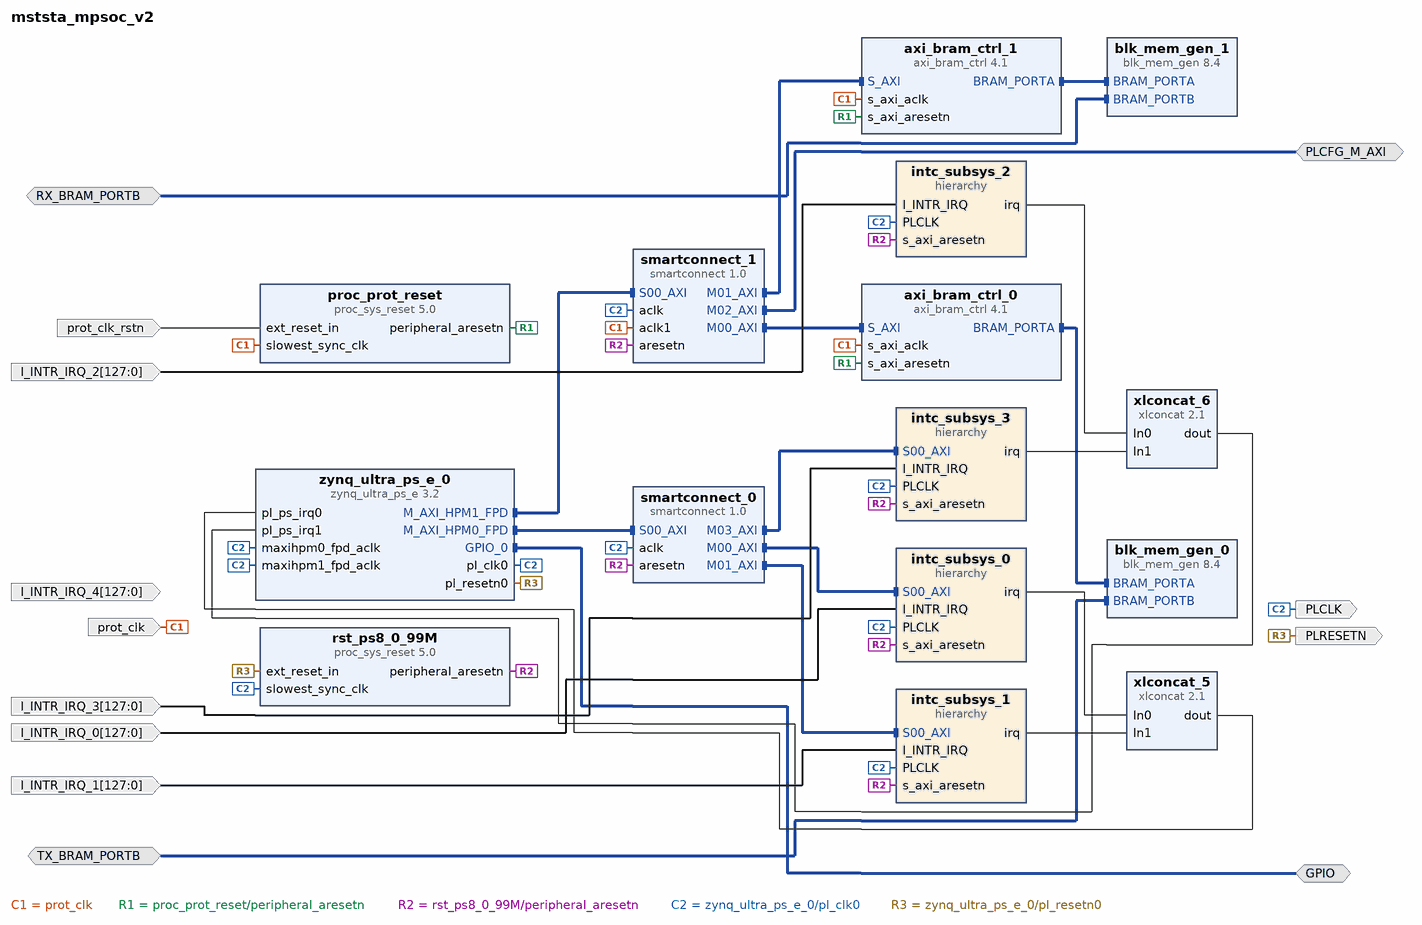
[diagram p0: block diagram of the top level]
# Vivado block design mststa_mpsoc_v2, xczu5eg-sfvc784-2-i, Vivado 2018.3
create_bd_design mststa_mpsoc_v2

create_bd_intf_port -mode Master -vlnv xilinx.com:interface:gpio_rtl:1.0 GPIO
create_bd_intf_port -mode Master -vlnv xilinx.com:interface:aximm_rtl:1.0 PLCFG_M_AXI
set_property -dict {CONFIG.ADDR_WIDTH 32 CONFIG.DATA_WIDTH 32 CONFIG.PROTOCOL AXI4LITE} [get_bd_intf_ports PLCFG_M_AXI]
create_bd_intf_port -mode Slave -vlnv xilinx.com:interface:bram_rtl:1.0 RX_BRAM_PORTB
set_property -dict {CONFIG.MASTER_TYPE BRAM_CTRL CONFIG.MEM_SIZE 65536 CONFIG.READ_LATENCY 1} [get_bd_intf_ports RX_BRAM_PORTB]
create_bd_intf_port -mode Slave -vlnv xilinx.com:interface:bram_rtl:1.0 TX_BRAM_PORTB
set_property -dict {CONFIG.MASTER_TYPE BRAM_CTRL CONFIG.MEM_SIZE 65536 CONFIG.READ_LATENCY 1} [get_bd_intf_ports TX_BRAM_PORTB]
create_bd_port -dir I -from 127 -to 0 I_INTR_IRQ_0
create_bd_port -dir I -from 127 -to 0 I_INTR_IRQ_1
create_bd_port -dir I -from 127 -to 0 I_INTR_IRQ_2
create_bd_port -dir I -from 127 -to 0 I_INTR_IRQ_3
create_bd_port -dir I -from 127 -to 0 I_INTR_IRQ_4
create_bd_port -dir O -type clk PLCLK
set_property -dict {CONFIG.ASSOCIATED_BUSIF PLCFG_M_AXI} [get_bd_ports PLCLK]
create_bd_port -dir O -type rst PLRESETN
create_bd_port -dir I -type clk prot_clk
set_property -dict {CONFIG.FREQ_HZ 156250000} [get_bd_ports prot_clk]
create_bd_port -dir I -type rst prot_clk_rstn

create_bd_cell -type ip -vlnv xilinx.com:ip:axi_bram_ctrl:4.1 axi_bram_ctrl_0
set_property -dict {CONFIG.PROTOCOL AXI4LITE CONFIG.SINGLE_PORT_BRAM 1} [get_bd_cells axi_bram_ctrl_0]
create_bd_cell -type ip -vlnv xilinx.com:ip:axi_bram_ctrl:4.1 axi_bram_ctrl_1
set_property -dict {CONFIG.PROTOCOL AXI4LITE CONFIG.SINGLE_PORT_BRAM 1} [get_bd_cells axi_bram_ctrl_1]
create_bd_cell -type ip -vlnv xilinx.com:ip:blk_mem_gen:8.4 blk_mem_gen_0
set_property -dict [list \
  CONFIG.Memory_Type True_Dual_Port_RAM \
  CONFIG.PRIM_type_to_Implement URAM \
  CONFIG.Port_B_Clock 100 \
  CONFIG.Port_B_Enable_Rate 100 \
  CONFIG.Port_B_Write_Rate 50 \
  CONFIG.Use_RSTB_Pin true \
] [get_bd_cells blk_mem_gen_0]
create_bd_cell -type ip -vlnv xilinx.com:ip:blk_mem_gen:8.4 blk_mem_gen_1
set_property -dict [list \
  CONFIG.Memory_Type True_Dual_Port_RAM \
  CONFIG.PRIM_type_to_Implement URAM \
  CONFIG.Port_B_Clock 100 \
  CONFIG.Port_B_Enable_Rate 100 \
  CONFIG.Port_B_Write_Rate 50 \
  CONFIG.Use_RSTB_Pin true \
] [get_bd_cells blk_mem_gen_1]
create_bd_cell -type hier intc_subsys_0
create_bd_cell -type hier intc_subsys_1
create_bd_cell -type hier intc_subsys_2
create_bd_cell -type ip -vlnv xilinx.com:ip:proc_sys_reset:5.0 proc_prot_reset
create_bd_cell -type ip -vlnv xilinx.com:ip:proc_sys_reset:5.0 rst_ps8_0_99M
create_bd_cell -type ip -vlnv xilinx.com:ip:smartconnect:1.0 smartconnect_0
set_property -dict [list \
  CONFIG.ADVANCED_PROPERTIES {  __view__ { functional { S00_Buffer { AR_SIZE 0 AW_SIZE 0 B_SIZE 0 R_SIZE 0 W_SIZE 0 } M01_Buffer { AR_SIZE 0 AW_SIZE 0 B_SIZE 0 R_SIZE 0 W_SIZE 0 } M00_Buffer { AR_SIZE 0 AW_SIZE 0 B_SIZE 0 R_SIZE 0 W_SIZE 0 } M02_Buffer { AR_SIZE 0 AW_SIZE 0 B_SIZE 0 R_SIZE 0 W_SIZE 0 } M03_Buffer { AR_SIZE 0 AW_SIZE 0 B_SIZE 0 R_SIZE 0 W_SIZE 0 } M04_Buffer { AR_SIZE 0 AW_SIZE 0 B_SIZE 0 R_SIZE 0 W_SIZE 0 } M05_Buffer { AR_SIZE 0 AW_SIZE 0 B_SIZE 0 R_SIZE 0 W_SIZE 0 } S00_Entry { SUPPORTS_WRAP 0 LIM_R_LEN 0 LIM_W_LEN 0 PKT_R_THR 0 PKT_W_THR 0 } SW0 { DATA_WIDTH 128 } } } } \
  CONFIG.NUM_MI 4 \
  CONFIG.NUM_SI 1 \
] [get_bd_cells smartconnect_0]
create_bd_cell -type ip -vlnv xilinx.com:ip:smartconnect:1.0 smartconnect_1
set_property -dict [list \
  CONFIG.ADVANCED_PROPERTIES {  __view__ { functional { S00_Buffer { AR_SIZE 0 AW_SIZE 0 B_SIZE 0 R_SIZE 0 W_SIZE 0 } M01_Buffer { AR_SIZE 16 AW_SIZE 16 B_SIZE 16 R_SIZE 16 W_SIZE 16 } M00_Buffer { AR_SIZE 16 AW_SIZE 16 B_SIZE 16 R_SIZE 16 W_SIZE 16 } M02_Buffer { AR_SIZE 0 AW_SIZE 0 B_SIZE 0 R_SIZE 0 W_SIZE 0 } S00_Entry { SUPPORTS_WRAP 0 LIM_R_LEN 0 LIM_W_LEN 0 } SW0 { DATA_WIDTH 32 } } } } \
  CONFIG.NUM_CLKS 2 \
  CONFIG.NUM_MI 3 \
  CONFIG.NUM_SI 1 \
] [get_bd_cells smartconnect_1]
create_bd_cell -type ip -vlnv xilinx.com:ip:xlconcat:2.1 xlconcat_5
set_property -dict {CONFIG.NUM_PORTS 2} [get_bd_cells xlconcat_5]
create_bd_cell -type ip -vlnv xilinx.com:ip:zynq_ultra_ps_e:3.2 zynq_ultra_ps_e_0
set_property -dict [list \
  CONFIG.CAN0_BOARD_INTERFACE custom \
  CONFIG.CAN1_BOARD_INTERFACE custom \
  CONFIG.CSU_BOARD_INTERFACE custom \
  CONFIG.DP_BOARD_INTERFACE custom \
  CONFIG.GEM0_BOARD_INTERFACE custom \
  CONFIG.GEM1_BOARD_INTERFACE custom \
  CONFIG.GEM2_BOARD_INTERFACE custom \
  CONFIG.GEM3_BOARD_INTERFACE custom \
  CONFIG.GPIO_BOARD_INTERFACE custom \
  CONFIG.IIC0_BOARD_INTERFACE custom \
  CONFIG.IIC1_BOARD_INTERFACE custom \
  CONFIG.NAND_BOARD_INTERFACE custom \
  CONFIG.PCIE_BOARD_INTERFACE custom \
  CONFIG.PJTAG_BOARD_INTERFACE custom \
  CONFIG.PMU_BOARD_INTERFACE custom \
  CONFIG.PSU_BANK_0_IO_STANDARD LVCMOS33 \
  CONFIG.PSU_BANK_1_IO_STANDARD LVCMOS33 \
  CONFIG.PSU_BANK_2_IO_STANDARD LVCMOS33 \
  CONFIG.PSU_BANK_3_IO_STANDARD LVCMOS33 \
  CONFIG.PSU__CAN0__PERIPHERAL__ENABLE 1 \
  CONFIG.PSU__CAN0__PERIPHERAL__IO {MIO 18 .. 19} \
  CONFIG.PSU__CAN1__PERIPHERAL__ENABLE 1 \
  CONFIG.PSU__CAN1__PERIPHERAL__IO {MIO 24 .. 25} \
  CONFIG.PSU__CRF_APB__ACPU_CTRL__FREQMHZ 1200 \
  CONFIG.PSU__CRF_APB__ACPU_CTRL__SRCSEL APLL \
  CONFIG.PSU__CRF_APB__APLL_CTRL__SRCSEL PSS_REF_CLK \
  CONFIG.PSU__CRF_APB__DBG_FPD_CTRL__FREQMHZ 250 \
  CONFIG.PSU__CRF_APB__DBG_FPD_CTRL__SRCSEL IOPLL \
  CONFIG.PSU__CRF_APB__DBG_TRACE_CTRL__FREQMHZ 250 \
  CONFIG.PSU__CRF_APB__DBG_TRACE_CTRL__SRCSEL IOPLL \
  CONFIG.PSU__CRF_APB__DBG_TSTMP_CTRL__FREQMHZ 250 \
  CONFIG.PSU__CRF_APB__DBG_TSTMP_CTRL__SRCSEL IOPLL \
  CONFIG.PSU__CRF_APB__DDR_CTRL__FREQMHZ 1067 \
  CONFIG.PSU__CRF_APB__DDR_CTRL__SRCSEL DPLL \
  CONFIG.PSU__CRF_APB__DPDMA_REF_CTRL__FREQMHZ 600 \
  CONFIG.PSU__CRF_APB__DPDMA_REF_CTRL__SRCSEL APLL \
  CONFIG.PSU__CRF_APB__DPLL_CTRL__SRCSEL PSS_REF_CLK \
  CONFIG.PSU__CRF_APB__DP_AUDIO_REF_CTRL__SRCSEL RPLL \
  CONFIG.PSU__CRF_APB__DP_STC_REF_CTRL__SRCSEL RPLL \
  CONFIG.PSU__CRF_APB__DP_VIDEO_REF_CTRL__SRCSEL VPLL \
  CONFIG.PSU__CRF_APB__GDMA_REF_CTRL__FREQMHZ 600 \
  CONFIG.PSU__CRF_APB__GDMA_REF_CTRL__SRCSEL APLL \
  CONFIG.PSU__CRF_APB__GPU_REF_CTRL__FREQMHZ 500 \
  CONFIG.PSU__CRF_APB__GPU_REF_CTRL__SRCSEL IOPLL \
  CONFIG.PSU__CRF_APB__TOPSW_LSBUS_CTRL__FREQMHZ 100 \
  CONFIG.PSU__CRF_APB__TOPSW_LSBUS_CTRL__SRCSEL IOPLL \
  CONFIG.PSU__CRF_APB__TOPSW_MAIN_CTRL__FREQMHZ 533.33 \
  CONFIG.PSU__CRF_APB__TOPSW_MAIN_CTRL__SRCSEL DPLL \
  CONFIG.PSU__CRF_APB__VPLL_CTRL__SRCSEL PSS_REF_CLK \
  CONFIG.PSU__CRL_APB__ADMA_REF_CTRL__FREQMHZ 500 \
  CONFIG.PSU__CRL_APB__ADMA_REF_CTRL__SRCSEL IOPLL \
  CONFIG.PSU__CRL_APB__CAN1_REF_CTRL__FREQMHZ 100 \
  CONFIG.PSU__CRL_APB__CAN1_REF_CTRL__SRCSEL IOPLL \
  CONFIG.PSU__CRL_APB__CPU_R5_CTRL__FREQMHZ 500 \
  CONFIG.PSU__CRL_APB__CPU_R5_CTRL__SRCSEL IOPLL \
  CONFIG.PSU__CRL_APB__DBG_LPD_CTRL__FREQMHZ 250 \
  CONFIG.PSU__CRL_APB__DBG_LPD_CTRL__SRCSEL IOPLL \
  CONFIG.PSU__CRL_APB__GEM3_REF_CTRL__FREQMHZ 125 \
  CONFIG.PSU__CRL_APB__GEM3_REF_CTRL__SRCSEL IOPLL \
  CONFIG.PSU__CRL_APB__I2C0_REF_CTRL__FREQMHZ 100 \
  CONFIG.PSU__CRL_APB__I2C0_REF_CTRL__SRCSEL IOPLL \
  CONFIG.PSU__CRL_APB__I2C1_REF_CTRL__FREQMHZ 100 \
  CONFIG.PSU__CRL_APB__I2C1_REF_CTRL__SRCSEL IOPLL \
  CONFIG.PSU__CRL_APB__IOPLL_CTRL__SRCSEL PSS_REF_CLK \
  CONFIG.PSU__CRL_APB__IOU_SWITCH_CTRL__FREQMHZ 250 \
  CONFIG.PSU__CRL_APB__IOU_SWITCH_CTRL__SRCSEL IOPLL \
  CONFIG.PSU__CRL_APB__LPD_LSBUS_CTRL__FREQMHZ 100 \
  CONFIG.PSU__CRL_APB__LPD_LSBUS_CTRL__SRCSEL IOPLL \
  CONFIG.PSU__CRL_APB__LPD_SWITCH_CTRL__FREQMHZ 500 \
  CONFIG.PSU__CRL_APB__LPD_SWITCH_CTRL__SRCSEL IOPLL \
  CONFIG.PSU__CRL_APB__PCAP_CTRL__FREQMHZ 200 \
  CONFIG.PSU__CRL_APB__PCAP_CTRL__SRCSEL IOPLL \
  CONFIG.PSU__CRL_APB__PL0_REF_CTRL__FREQMHZ 100 \
  CONFIG.PSU__CRL_APB__PL0_REF_CTRL__SRCSEL IOPLL \
  CONFIG.PSU__CRL_APB__QSPI_REF_CTRL__FREQMHZ 125 \
  CONFIG.PSU__CRL_APB__QSPI_REF_CTRL__SRCSEL IOPLL \
  CONFIG.PSU__CRL_APB__RPLL_CTRL__SRCSEL PSS_REF_CLK \
  CONFIG.PSU__CRL_APB__SDIO1_REF_CTRL__FREQMHZ 200 \
  CONFIG.PSU__CRL_APB__SDIO1_REF_CTRL__SRCSEL IOPLL \
  CONFIG.PSU__CRL_APB__TIMESTAMP_REF_CTRL__FREQMHZ 100 \
  CONFIG.PSU__CRL_APB__TIMESTAMP_REF_CTRL__SRCSEL IOPLL \
  CONFIG.PSU__CRL_APB__UART0_REF_CTRL__FREQMHZ 100 \
  CONFIG.PSU__CRL_APB__UART0_REF_CTRL__SRCSEL IOPLL \
  CONFIG.PSU__CRL_APB__UART1_REF_CTRL__FREQMHZ 100 \
  CONFIG.PSU__CRL_APB__UART1_REF_CTRL__SRCSEL IOPLL \
  CONFIG.PSU__CRL_APB__USB0_BUS_REF_CTRL__FREQMHZ 250 \
  CONFIG.PSU__CRL_APB__USB0_BUS_REF_CTRL__SRCSEL IOPLL \
  CONFIG.PSU__CRL_APB__USB3_DUAL_REF_CTRL__FREQMHZ 20 \
  CONFIG.PSU__CRL_APB__USB3_DUAL_REF_CTRL__SRCSEL IOPLL \
  CONFIG.PSU__CRL_APB__USB3__ENABLE 1 \
  CONFIG.PSU__CSUPMU__PERIPHERAL__VALID 1 \
  CONFIG.PSU__DDRC__BUS_WIDTH {64 Bit} \
  CONFIG.PSU__DDRC__COMPONENTS Components \
  CONFIG.PSU__DDRC__DEVICE_CAPACITY {8192 MBits} \
  CONFIG.PSU__DDRC__DRAM_WIDTH {16 Bits} \
  CONFIG.PSU__DDRC__ECC Disabled \
  CONFIG.PSU__DDRC__MEMORY_TYPE {DDR 4} \
  CONFIG.PSU__DDRC__SPEED_BIN DDR4_2400R \
  CONFIG.PSU__DDR_HIGH_ADDRESS_GUI_ENABLE 1 \
  CONFIG.PSU__DDR__INTERFACE__FREQMHZ 533.500 \
  CONFIG.PSU__DEVICE_TYPE EG \
  CONFIG.PSU__DISPLAYPORT__LANE0__ENABLE 1 \
  CONFIG.PSU__DISPLAYPORT__LANE0__IO {GT Lane1} \
  CONFIG.PSU__DISPLAYPORT__LANE1__ENABLE 0 \
  CONFIG.PSU__DISPLAYPORT__PERIPHERAL__ENABLE 1 \
  CONFIG.PSU__DLL__ISUSED 0 \
  CONFIG.PSU__DPAUX__PERIPHERAL__ENABLE 1 \
  CONFIG.PSU__DPAUX__PERIPHERAL__IO {MIO 27 .. 30} \
  CONFIG.PSU__DP__LANE_SEL {Single Lower} \
  CONFIG.PSU__DP__REF_CLK_FREQ 27 \
  CONFIG.PSU__DP__REF_CLK_SEL {Ref Clk1} \
  CONFIG.PSU__ENET1__GRP_MDIO__ENABLE 1 \
  CONFIG.PSU__ENET1__GRP_MDIO__IO {MIO 50 .. 51} \
  CONFIG.PSU__ENET1__PERIPHERAL__ENABLE 1 \
  CONFIG.PSU__ENET1__PERIPHERAL__IO {MIO 38 .. 49} \
  CONFIG.PSU__ENET3__FIFO__ENABLE 0 \
  CONFIG.PSU__ENET3__GRP_MDIO__ENABLE 1 \
  CONFIG.PSU__ENET3__GRP_MDIO__IO {MIO 76 .. 77} \
  CONFIG.PSU__ENET3__PERIPHERAL__ENABLE 1 \
  CONFIG.PSU__ENET3__PERIPHERAL__IO {MIO 64 .. 75} \
  CONFIG.PSU__ENET3__PTP__ENABLE 0 \
  CONFIG.PSU__ENET3__TSU__ENABLE 0 \
  CONFIG.PSU__FPGA_PL0_ENABLE 1 \
  CONFIG.PSU__GEM3_COHERENCY 0 \
  CONFIG.PSU__GEM__TSU__ENABLE 0 \
  CONFIG.PSU__GPIO0_MIO__IO {MIO 0 .. 25} \
  CONFIG.PSU__GPIO0_MIO__PERIPHERAL__ENABLE 1 \
  CONFIG.PSU__GPIO1_MIO__IO {MIO 26 .. 51} \
  CONFIG.PSU__GPIO1_MIO__PERIPHERAL__ENABLE 1 \
  CONFIG.PSU__GPIO_EMIO_WIDTH 8 \
  CONFIG.PSU__GPIO_EMIO__PERIPHERAL__ENABLE 1 \
  CONFIG.PSU__GPIO_EMIO__PERIPHERAL__IO 8 \
  CONFIG.PSU__GT__LINK_SPEED HBR \
  CONFIG.PSU__GT__PRE_EMPH_LVL_4 0 \
  CONFIG.PSU__GT__VLT_SWNG_LVL_4 0 \
  CONFIG.PSU__I2C0__PERIPHERAL__ENABLE 0 \
  CONFIG.PSU__I2C1__PERIPHERAL__ENABLE 0 \
  CONFIG.PSU__IOU_SLCR__IOU_TTC_APB_CLK__TTC0_SEL APB \
  CONFIG.PSU__IOU_SLCR__IOU_TTC_APB_CLK__TTC1_SEL APB \
  CONFIG.PSU__IOU_SLCR__IOU_TTC_APB_CLK__TTC2_SEL APB \
  CONFIG.PSU__IOU_SLCR__IOU_TTC_APB_CLK__TTC3_SEL APB \
  CONFIG.PSU__MAXIGP0__DATA_WIDTH 128 \
  CONFIG.PSU__OVERRIDE__BASIC_CLOCK 0 \
  CONFIG.PSU__PCIE__CLASS_CODE_BASE 0x06 \
  CONFIG.PSU__PCIE__CLASS_CODE_INTERFACE 0x0 \
  CONFIG.PSU__PCIE__CLASS_CODE_SUB 0x4 \
  CONFIG.PSU__PCIE__DEVICE_ID 0xD021 \
  CONFIG.PSU__PCIE__REVISION_ID 0x0 \
  CONFIG.PSU__PCIE__SUBSYSTEM_ID 0x7 \
  CONFIG.PSU__PCIE__SUBSYSTEM_VENDOR_ID 0x10EE \
  CONFIG.PSU__PCIE__VENDOR_ID 0x10EE \
  CONFIG.PSU__PMU_COHERENCY 0 \
  CONFIG.PSU__PMU__AIBACK__ENABLE 0 \
  CONFIG.PSU__PMU__EMIO_GPI__ENABLE 0 \
  CONFIG.PSU__PMU__EMIO_GPO__ENABLE 0 \
  CONFIG.PSU__PMU__GPI0__ENABLE 0 \
  CONFIG.PSU__PMU__GPI1__ENABLE 0 \
  CONFIG.PSU__PMU__GPI2__ENABLE 0 \
  CONFIG.PSU__PMU__GPI3__ENABLE 0 \
  CONFIG.PSU__PMU__GPI4__ENABLE 0 \
  CONFIG.PSU__PMU__GPI5__ENABLE 0 \
  CONFIG.PSU__PMU__GPO0__ENABLE 0 \
  CONFIG.PSU__PMU__GPO1__ENABLE 0 \
  CONFIG.PSU__PMU__GPO2__ENABLE 1 \
  CONFIG.PSU__PMU__GPO2__IO {MIO 34} \
  CONFIG.PSU__PMU__GPO2__POLARITY high \
  CONFIG.PSU__PMU__GPO3__ENABLE 0 \
  CONFIG.PSU__PMU__GPO4__ENABLE 0 \
  CONFIG.PSU__PMU__GPO5__ENABLE 0 \
  CONFIG.PSU__PMU__PERIPHERAL__ENABLE 1 \
  CONFIG.PSU__PMU__PLERROR__ENABLE 0 \
  CONFIG.PSU__PRESET_APPLIED 1 \
  CONFIG.PSU__PSS_REF_CLK__FREQMHZ 33.330 \
  CONFIG.PSU__QSPI_COHERENCY 0 \
  CONFIG.PSU__QSPI__GRP_FBCLK__ENABLE 1 \
  CONFIG.PSU__QSPI__GRP_FBCLK__IO {MIO 6} \
  CONFIG.PSU__QSPI__PERIPHERAL__DATA_MODE x4 \
  CONFIG.PSU__QSPI__PERIPHERAL__ENABLE 1 \
  CONFIG.PSU__QSPI__PERIPHERAL__IO {MIO 0 .. 12} \
  CONFIG.PSU__QSPI__PERIPHERAL__MODE {Dual Parallel} \
  CONFIG.PSU__SATA__LANE1__IO {GT Lane3} \
  CONFIG.PSU__SATA__PERIPHERAL__ENABLE 1 \
  CONFIG.PSU__SATA__REF_CLK_FREQ 125 \
  CONFIG.PSU__SATA__REF_CLK_SEL {Ref Clk2} \
  CONFIG.PSU__SD1__PERIPHERAL__ENABLE 0 \
  CONFIG.PSU__SWDT0__CLOCK__ENABLE 0 \
  CONFIG.PSU__SWDT0__PERIPHERAL__ENABLE 1 \
  CONFIG.PSU__SWDT0__RESET__ENABLE 0 \
  CONFIG.PSU__SWDT1__CLOCK__ENABLE 0 \
  CONFIG.PSU__SWDT1__PERIPHERAL__ENABLE 1 \
  CONFIG.PSU__SWDT1__RESET__ENABLE 0 \
  CONFIG.PSU__TSU__BUFG_PORT_PAIR 0 \
  CONFIG.PSU__TTC0__CLOCK__ENABLE 0 \
  CONFIG.PSU__TTC0__PERIPHERAL__ENABLE 1 \
  CONFIG.PSU__TTC0__WAVEOUT__ENABLE 0 \
  CONFIG.PSU__TTC1__CLOCK__ENABLE 0 \
  CONFIG.PSU__TTC1__PERIPHERAL__ENABLE 1 \
  CONFIG.PSU__TTC1__WAVEOUT__ENABLE 0 \
  CONFIG.PSU__TTC2__CLOCK__ENABLE 0 \
  CONFIG.PSU__TTC2__PERIPHERAL__ENABLE 1 \
  CONFIG.PSU__TTC2__WAVEOUT__ENABLE 0 \
  CONFIG.PSU__TTC3__CLOCK__ENABLE 0 \
  CONFIG.PSU__TTC3__PERIPHERAL__ENABLE 1 \
  CONFIG.PSU__TTC3__WAVEOUT__ENABLE 0 \
  CONFIG.PSU__UART0__BAUD_RATE 115200 \
  CONFIG.PSU__UART0__MODEM__ENABLE 0 \
  CONFIG.PSU__UART0__PERIPHERAL__ENABLE 1 \
  CONFIG.PSU__UART0__PERIPHERAL__IO {MIO 14 .. 15} \
  CONFIG.PSU__UART1__BAUD_RATE 115200 \
  CONFIG.PSU__UART1__MODEM__ENABLE 0 \
  CONFIG.PSU__UART1__PERIPHERAL__ENABLE 1 \
  CONFIG.PSU__UART1__PERIPHERAL__IO {MIO 16 .. 17} \
  CONFIG.PSU__USB0_COHERENCY 0 \
  CONFIG.PSU__USB0__PERIPHERAL__ENABLE 1 \
  CONFIG.PSU__USB0__PERIPHERAL__IO {MIO 52 .. 63} \
  CONFIG.PSU__USB0__REF_CLK_FREQ 26 \
  CONFIG.PSU__USB0__REF_CLK_SEL {Ref Clk0} \
  CONFIG.PSU__USB2_0__EMIO__ENABLE 0 \
  CONFIG.PSU__USB3_0__EMIO__ENABLE 0 \
  CONFIG.PSU__USB3_0__PERIPHERAL__ENABLE 1 \
  CONFIG.PSU__USB3_0__PERIPHERAL__IO {GT Lane2} \
  CONFIG.PSU__USB__RESET__MODE {Boot Pin} \
  CONFIG.PSU__USB__RESET__POLARITY {Active Low} \
  CONFIG.PSU__USE__IRQ0 1 \
  CONFIG.PSU__USE__IRQ1 1 \
  CONFIG.PSU__USE__M_AXI_GP0 1 \
  CONFIG.PSU__USE__M_AXI_GP1 1 \
  CONFIG.PSU__USE__M_AXI_GP2 0 \
  CONFIG.QSPI_BOARD_INTERFACE custom \
  CONFIG.SATA_BOARD_INTERFACE custom \
  CONFIG.SD0_BOARD_INTERFACE custom \
  CONFIG.SD1_BOARD_INTERFACE custom \
  CONFIG.SPI0_BOARD_INTERFACE custom \
  CONFIG.SPI1_BOARD_INTERFACE custom \
  CONFIG.SUBPRESET1 Custom \
  CONFIG.SUBPRESET2 Custom \
  CONFIG.SWDT0_BOARD_INTERFACE custom \
  CONFIG.SWDT1_BOARD_INTERFACE custom \
  CONFIG.TRACE_BOARD_INTERFACE custom \
  CONFIG.TTC0_BOARD_INTERFACE custom \
  CONFIG.TTC1_BOARD_INTERFACE custom \
  CONFIG.TTC2_BOARD_INTERFACE custom \
  CONFIG.TTC3_BOARD_INTERFACE custom \
  CONFIG.UART0_BOARD_INTERFACE custom \
  CONFIG.UART1_BOARD_INTERFACE custom \
  CONFIG.USB0_BOARD_INTERFACE custom \
  CONFIG.USB1_BOARD_INTERFACE custom \
] [get_bd_cells zynq_ultra_ps_e_0]
# 707 more settings of zynq_ultra_ps_e_0 are not shown: defaults, MIO pin electricals, DDR timing, and values the tool derives
create_bd_cell -type ip -vlnv xilinx.com:ip:xlconcat:2.1 xlconcat_6
set_property -dict {CONFIG.NUM_PORTS 2} [get_bd_cells xlconcat_6]
create_bd_cell -type hier intc_subsys_3

# ---- hierarchy /intc_subsys_0 ----
current_bd_instance /intc_subsys_0
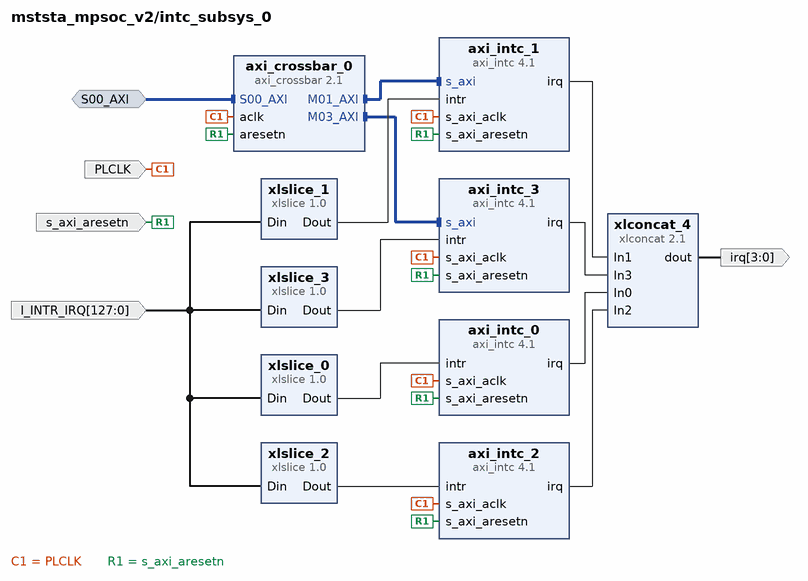
[diagram p1: block diagram inside /intc_subsys_0]
create_bd_intf_pin -mode Slave -vlnv xilinx.com:interface:aximm_rtl:1.0 S00_AXI
create_bd_pin -dir I -type clk PLCLK
create_bd_pin -dir I -type rst s_axi_aresetn
create_bd_pin -dir O -from 3 -to 0 -type intr irq
create_bd_pin -dir I -from 127 -to 0 I_INTR_IRQ

create_bd_cell -type ip -vlnv xilinx.com:ip:axi_intc:4.1 axi_intc_0
set_property -dict [list \
  CONFIG.C_CASCADE_MASTER 0 \
  CONFIG.C_EN_CASCADE_MODE 0 \
  CONFIG.C_IRQ_CONNECTION 1 \
  CONFIG.C_IRQ_IS_LEVEL 0 \
  CONFIG.C_KIND_OF_EDGE 0xFFFFFFFF \
  CONFIG.C_KIND_OF_INTR 0xFFFFFFFF \
] [get_bd_cells axi_intc_0]
create_bd_cell -type ip -vlnv xilinx.com:ip:axi_intc:4.1 axi_intc_1
set_property -dict [list \
  CONFIG.C_EN_CASCADE_MODE 0 \
  CONFIG.C_IRQ_CONNECTION 1 \
  CONFIG.C_IRQ_IS_LEVEL 0 \
  CONFIG.C_KIND_OF_EDGE 0xFFFFFFFF \
  CONFIG.C_KIND_OF_INTR 0xFFFFFFFF \
] [get_bd_cells axi_intc_1]
create_bd_cell -type ip -vlnv xilinx.com:ip:xlslice:1.0 xlslice_0
set_property -dict {CONFIG.DIN_FROM 31 CONFIG.DIN_TO 0 CONFIG.DIN_WIDTH 128 CONFIG.DOUT_WIDTH 32} [get_bd_cells xlslice_0]
create_bd_cell -type ip -vlnv xilinx.com:ip:xlslice:1.0 xlslice_1
set_property -dict {CONFIG.DIN_FROM 63 CONFIG.DIN_TO 32 CONFIG.DIN_WIDTH 128 CONFIG.DOUT_WIDTH 1} [get_bd_cells xlslice_1]
create_bd_cell -type ip -vlnv xilinx.com:ip:xlslice:1.0 xlslice_2
set_property -dict {CONFIG.DIN_FROM 95 CONFIG.DIN_TO 64 CONFIG.DIN_WIDTH 128 CONFIG.DOUT_WIDTH 1} [get_bd_cells xlslice_2]
create_bd_cell -type ip -vlnv xilinx.com:ip:xlslice:1.0 xlslice_3
set_property -dict {CONFIG.DIN_FROM 127 CONFIG.DIN_TO 96 CONFIG.DIN_WIDTH 128 CONFIG.DOUT_WIDTH 1} [get_bd_cells xlslice_3]
create_bd_cell -type ip -vlnv xilinx.com:ip:axi_intc:4.1 axi_intc_3
set_property -dict [list \
  CONFIG.C_EN_CASCADE_MODE 0 \
  CONFIG.C_IRQ_CONNECTION 1 \
  CONFIG.C_IRQ_IS_LEVEL 0 \
  CONFIG.C_KIND_OF_EDGE 0xFFFFFFFF \
  CONFIG.C_KIND_OF_INTR 0xFFFFFFFF \
] [get_bd_cells axi_intc_3]
create_bd_cell -type ip -vlnv xilinx.com:ip:axi_intc:4.1 axi_intc_2
set_property -dict [list \
  CONFIG.C_EN_CASCADE_MODE 0 \
  CONFIG.C_IRQ_CONNECTION 1 \
  CONFIG.C_IRQ_IS_LEVEL 0 \
  CONFIG.C_KIND_OF_EDGE 0xFFFFFFFF \
  CONFIG.C_KIND_OF_INTR 0xFFFFFFFF \
] [get_bd_cells axi_intc_2]
create_bd_cell -type ip -vlnv xilinx.com:ip:xlconcat:2.1 xlconcat_4
set_property -dict {CONFIG.NUM_PORTS 4} [get_bd_cells xlconcat_4]
create_bd_cell -type ip -vlnv xilinx.com:ip:axi_crossbar:2.1 axi_crossbar_0
set_property -dict {CONFIG.NUM_MI 4 CONFIG.PROTOCOL AXI4LITE CONFIG.R_REGISTER 1} [get_bd_cells axi_crossbar_0]

# ---- hierarchy /intc_subsys_1 ----
current_bd_instance /intc_subsys_1
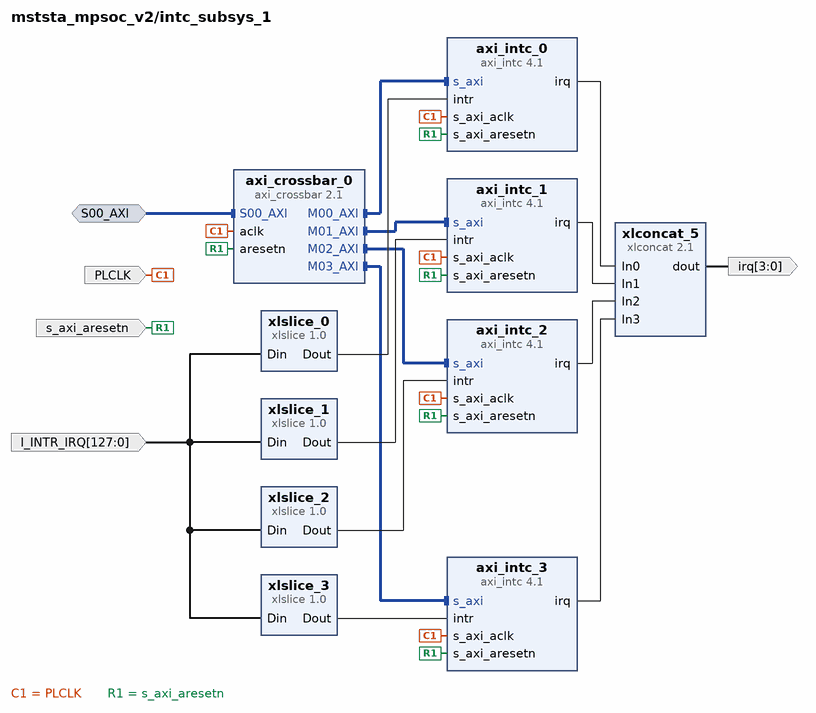
[diagram p2: block diagram inside /intc_subsys_1]
create_bd_intf_pin -mode Slave -vlnv xilinx.com:interface:aximm_rtl:1.0 S00_AXI
create_bd_pin -dir I -type clk PLCLK
create_bd_pin -dir I -type rst s_axi_aresetn
create_bd_pin -dir I -from 127 -to 0 I_INTR_IRQ
create_bd_pin -dir O -from 3 -to 0 -type intr irq

create_bd_cell -type ip -vlnv xilinx.com:ip:axi_intc:4.1 axi_intc_2
set_property -dict [list \
  CONFIG.C_EN_CASCADE_MODE 0 \
  CONFIG.C_IRQ_CONNECTION 1 \
  CONFIG.C_IRQ_IS_LEVEL 0 \
  CONFIG.C_KIND_OF_EDGE 0xFFFFFFFF \
  CONFIG.C_KIND_OF_INTR 0xFFFFFFFF \
] [get_bd_cells axi_intc_2]
create_bd_cell -type ip -vlnv xilinx.com:ip:axi_intc:4.1 axi_intc_3
set_property -dict [list \
  CONFIG.C_EN_CASCADE_MODE 0 \
  CONFIG.C_IRQ_CONNECTION 1 \
  CONFIG.C_IRQ_IS_LEVEL 0 \
  CONFIG.C_KIND_OF_EDGE 0xFFFFFFFF \
  CONFIG.C_KIND_OF_INTR 0xFFFFFFFF \
] [get_bd_cells axi_intc_3]
create_bd_cell -type ip -vlnv xilinx.com:ip:axi_intc:4.1 axi_intc_1
set_property -dict [list \
  CONFIG.C_EN_CASCADE_MODE 0 \
  CONFIG.C_IRQ_CONNECTION 1 \
  CONFIG.C_IRQ_IS_LEVEL 0 \
  CONFIG.C_KIND_OF_EDGE 0xFFFFFFFF \
  CONFIG.C_KIND_OF_INTR 0xFFFFFFFF \
] [get_bd_cells axi_intc_1]
create_bd_cell -type ip -vlnv xilinx.com:ip:xlslice:1.0 xlslice_0
set_property -dict {CONFIG.DIN_FROM 31 CONFIG.DIN_TO 0 CONFIG.DIN_WIDTH 128 CONFIG.DOUT_WIDTH 32} [get_bd_cells xlslice_0]
create_bd_cell -type ip -vlnv xilinx.com:ip:xlslice:1.0 xlslice_1
set_property -dict {CONFIG.DIN_FROM 63 CONFIG.DIN_TO 32 CONFIG.DIN_WIDTH 128 CONFIG.DOUT_WIDTH 1} [get_bd_cells xlslice_1]
create_bd_cell -type ip -vlnv xilinx.com:ip:xlslice:1.0 xlslice_2
set_property -dict {CONFIG.DIN_FROM 95 CONFIG.DIN_TO 64 CONFIG.DIN_WIDTH 128 CONFIG.DOUT_WIDTH 1} [get_bd_cells xlslice_2]
create_bd_cell -type ip -vlnv xilinx.com:ip:axi_intc:4.1 axi_intc_0
set_property -dict [list \
  CONFIG.C_CASCADE_MASTER 0 \
  CONFIG.C_EN_CASCADE_MODE 0 \
  CONFIG.C_IRQ_CONNECTION 1 \
  CONFIG.C_IRQ_IS_LEVEL 0 \
  CONFIG.C_KIND_OF_EDGE 0xFFFFFFFF \
  CONFIG.C_KIND_OF_INTR 0xFFFFFFFF \
] [get_bd_cells axi_intc_0]
create_bd_cell -type ip -vlnv xilinx.com:ip:xlslice:1.0 xlslice_3
set_property -dict {CONFIG.DIN_FROM 127 CONFIG.DIN_TO 96 CONFIG.DIN_WIDTH 128 CONFIG.DOUT_WIDTH 1} [get_bd_cells xlslice_3]
create_bd_cell -type ip -vlnv xilinx.com:ip:xlconcat:2.1 xlconcat_5
set_property -dict {CONFIG.NUM_PORTS 4} [get_bd_cells xlconcat_5]
create_bd_cell -type ip -vlnv xilinx.com:ip:axi_crossbar:2.1 axi_crossbar_0
set_property -dict {CONFIG.NUM_MI 4 CONFIG.PROTOCOL AXI4LITE CONFIG.R_REGISTER 1} [get_bd_cells axi_crossbar_0]

# ---- hierarchy /intc_subsys_2 ----
current_bd_instance /intc_subsys_2
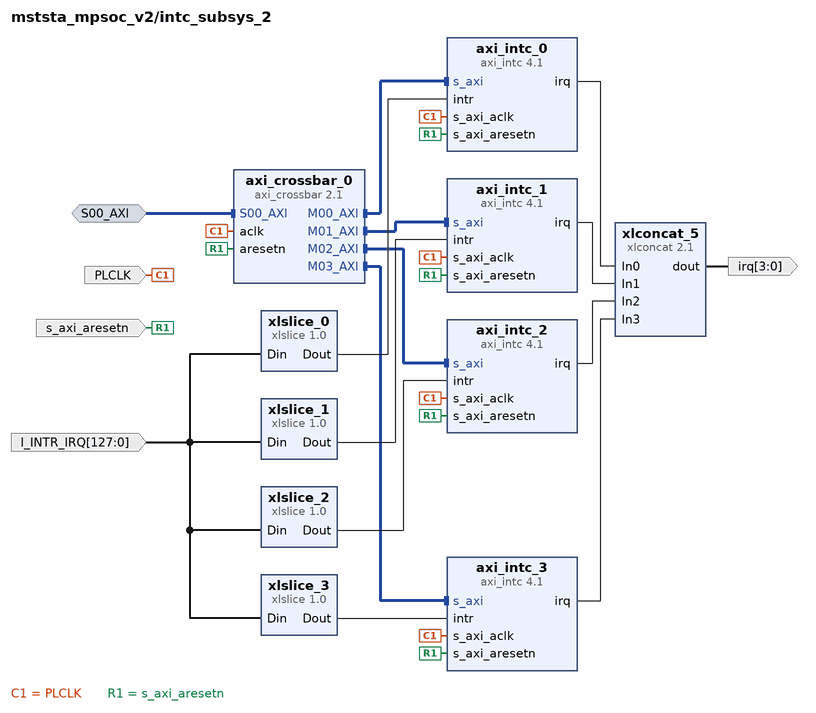
[diagram p3: block diagram inside /intc_subsys_2]
create_bd_intf_pin -mode Slave -vlnv xilinx.com:interface:aximm_rtl:1.0 S00_AXI
create_bd_pin -dir I -type clk PLCLK
create_bd_pin -dir I -type rst s_axi_aresetn
create_bd_pin -dir I -from 127 -to 0 I_INTR_IRQ
create_bd_pin -dir O -from 3 -to 0 -type intr irq

create_bd_cell -type ip -vlnv xilinx.com:ip:axi_intc:4.1 axi_intc_2
set_property -dict [list \
  CONFIG.C_EN_CASCADE_MODE 0 \
  CONFIG.C_IRQ_CONNECTION 1 \
  CONFIG.C_IRQ_IS_LEVEL 0 \
  CONFIG.C_KIND_OF_EDGE 0xFFFFFFFF \
  CONFIG.C_KIND_OF_INTR 0xFFFFFFFF \
] [get_bd_cells axi_intc_2]
create_bd_cell -type ip -vlnv xilinx.com:ip:axi_intc:4.1 axi_intc_3
set_property -dict [list \
  CONFIG.C_EN_CASCADE_MODE 0 \
  CONFIG.C_IRQ_CONNECTION 1 \
  CONFIG.C_IRQ_IS_LEVEL 0 \
  CONFIG.C_KIND_OF_EDGE 0xFFFFFFFF \
  CONFIG.C_KIND_OF_INTR 0xFFFFFFFF \
] [get_bd_cells axi_intc_3]
create_bd_cell -type ip -vlnv xilinx.com:ip:axi_intc:4.1 axi_intc_1
set_property -dict [list \
  CONFIG.C_EN_CASCADE_MODE 0 \
  CONFIG.C_IRQ_CONNECTION 1 \
  CONFIG.C_IRQ_IS_LEVEL 0 \
  CONFIG.C_KIND_OF_EDGE 0xFFFFFFFF \
  CONFIG.C_KIND_OF_INTR 0xFFFFFFFF \
] [get_bd_cells axi_intc_1]
create_bd_cell -type ip -vlnv xilinx.com:ip:xlslice:1.0 xlslice_0
set_property -dict {CONFIG.DIN_FROM 31 CONFIG.DIN_TO 0 CONFIG.DIN_WIDTH 128 CONFIG.DOUT_WIDTH 32} [get_bd_cells xlslice_0]
create_bd_cell -type ip -vlnv xilinx.com:ip:xlslice:1.0 xlslice_1
set_property -dict {CONFIG.DIN_FROM 63 CONFIG.DIN_TO 32 CONFIG.DIN_WIDTH 128 CONFIG.DOUT_WIDTH 1} [get_bd_cells xlslice_1]
create_bd_cell -type ip -vlnv xilinx.com:ip:xlslice:1.0 xlslice_2
set_property -dict {CONFIG.DIN_FROM 95 CONFIG.DIN_TO 64 CONFIG.DIN_WIDTH 128 CONFIG.DOUT_WIDTH 1} [get_bd_cells xlslice_2]
create_bd_cell -type ip -vlnv xilinx.com:ip:axi_intc:4.1 axi_intc_0
set_property -dict [list \
  CONFIG.C_CASCADE_MASTER 0 \
  CONFIG.C_EN_CASCADE_MODE 0 \
  CONFIG.C_IRQ_CONNECTION 1 \
  CONFIG.C_IRQ_IS_LEVEL 0 \
  CONFIG.C_KIND_OF_EDGE 0xFFFFFFFF \
  CONFIG.C_KIND_OF_INTR 0xFFFFFFFF \
] [get_bd_cells axi_intc_0]
create_bd_cell -type ip -vlnv xilinx.com:ip:xlslice:1.0 xlslice_3
set_property -dict {CONFIG.DIN_FROM 127 CONFIG.DIN_TO 96 CONFIG.DIN_WIDTH 128 CONFIG.DOUT_WIDTH 1} [get_bd_cells xlslice_3]
create_bd_cell -type ip -vlnv xilinx.com:ip:xlconcat:2.1 xlconcat_5
set_property -dict {CONFIG.NUM_PORTS 4} [get_bd_cells xlconcat_5]
create_bd_cell -type ip -vlnv xilinx.com:ip:axi_crossbar:2.1 axi_crossbar_0
set_property -dict {CONFIG.NUM_MI 4 CONFIG.PROTOCOL AXI4LITE CONFIG.R_REGISTER 1} [get_bd_cells axi_crossbar_0]

# ---- hierarchy /intc_subsys_3 ----
current_bd_instance /intc_subsys_3
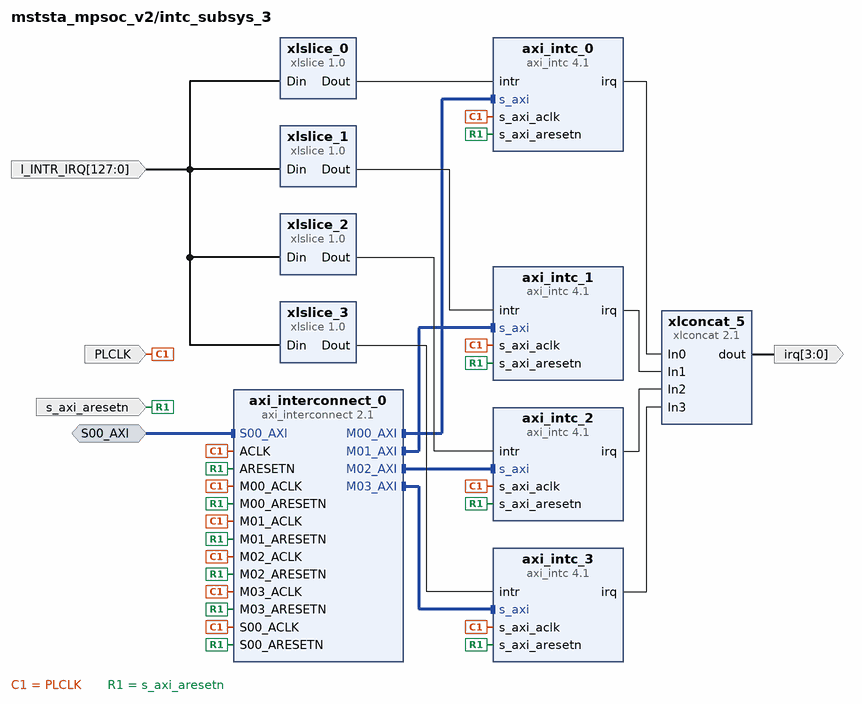
[diagram p4: block diagram inside /intc_subsys_3]
create_bd_intf_pin -mode Slave -vlnv xilinx.com:interface:aximm_rtl:1.0 S00_AXI
create_bd_pin -dir I -type clk PLCLK
create_bd_pin -dir I -type rst s_axi_aresetn
create_bd_pin -dir I -from 127 -to 0 I_INTR_IRQ
create_bd_pin -dir O -from 3 -to 0 -type intr irq

create_bd_cell -type ip -vlnv xilinx.com:ip:axi_intc:4.1 axi_intc_2
set_property -dict [list \
  CONFIG.C_EN_CASCADE_MODE 0 \
  CONFIG.C_IRQ_CONNECTION 1 \
  CONFIG.C_IRQ_IS_LEVEL 0 \
  CONFIG.C_KIND_OF_EDGE 0xFFFFFFFF \
  CONFIG.C_KIND_OF_INTR 0xFFFFFFFF \
] [get_bd_cells axi_intc_2]
create_bd_cell -type ip -vlnv xilinx.com:ip:axi_intc:4.1 axi_intc_3
set_property -dict [list \
  CONFIG.C_EN_CASCADE_MODE 0 \
  CONFIG.C_IRQ_CONNECTION 1 \
  CONFIG.C_IRQ_IS_LEVEL 0 \
  CONFIG.C_KIND_OF_EDGE 0xFFFFFFFF \
  CONFIG.C_KIND_OF_INTR 0xFFFFFFFF \
] [get_bd_cells axi_intc_3]
create_bd_cell -type ip -vlnv xilinx.com:ip:axi_intc:4.1 axi_intc_1
set_property -dict [list \
  CONFIG.C_EN_CASCADE_MODE 0 \
  CONFIG.C_IRQ_CONNECTION 1 \
  CONFIG.C_IRQ_IS_LEVEL 0 \
  CONFIG.C_KIND_OF_EDGE 0xFFFFFFFF \
  CONFIG.C_KIND_OF_INTR 0xFFFFFFFF \
] [get_bd_cells axi_intc_1]
create_bd_cell -type ip -vlnv xilinx.com:ip:xlslice:1.0 xlslice_0
set_property -dict {CONFIG.DIN_FROM 31 CONFIG.DIN_TO 0 CONFIG.DIN_WIDTH 128 CONFIG.DOUT_WIDTH 32} [get_bd_cells xlslice_0]
create_bd_cell -type ip -vlnv xilinx.com:ip:xlslice:1.0 xlslice_1
set_property -dict {CONFIG.DIN_FROM 63 CONFIG.DIN_TO 32 CONFIG.DIN_WIDTH 128 CONFIG.DOUT_WIDTH 1} [get_bd_cells xlslice_1]
create_bd_cell -type ip -vlnv xilinx.com:ip:xlslice:1.0 xlslice_2
set_property -dict {CONFIG.DIN_FROM 95 CONFIG.DIN_TO 64 CONFIG.DIN_WIDTH 128 CONFIG.DOUT_WIDTH 1} [get_bd_cells xlslice_2]
create_bd_cell -type ip -vlnv xilinx.com:ip:axi_intc:4.1 axi_intc_0
set_property -dict [list \
  CONFIG.C_CASCADE_MASTER 0 \
  CONFIG.C_EN_CASCADE_MODE 0 \
  CONFIG.C_IRQ_CONNECTION 1 \
  CONFIG.C_IRQ_IS_LEVEL 0 \
  CONFIG.C_KIND_OF_EDGE 0xFFFFFFFF \
  CONFIG.C_KIND_OF_INTR 0xFFFFFFFF \
] [get_bd_cells axi_intc_0]
create_bd_cell -type ip -vlnv xilinx.com:ip:xlslice:1.0 xlslice_3
set_property -dict {CONFIG.DIN_FROM 127 CONFIG.DIN_TO 96 CONFIG.DIN_WIDTH 128 CONFIG.DOUT_WIDTH 1} [get_bd_cells xlslice_3]
create_bd_cell -type ip -vlnv xilinx.com:ip:xlconcat:2.1 xlconcat_5
set_property -dict {CONFIG.NUM_PORTS 4} [get_bd_cells xlconcat_5]
create_bd_cell -type ip -vlnv xilinx.com:ip:axi_interconnect:2.1 axi_interconnect_0
set_property -dict [list \
  CONFIG.ENABLE_ADVANCED_OPTIONS 1 \
  CONFIG.NUM_MI 4 \
  CONFIG.S00_HAS_DATA_FIFO 0 \
  CONFIG.S00_HAS_REGSLICE 0 \
] [get_bd_cells axi_interconnect_0]

# ---- connections ----

current_bd_instance /intc_subsys_0
connect_bd_intf_net [get_bd_intf_pins axi_intc_1/s_axi] [get_bd_intf_pins axi_crossbar_0/M01_AXI]
connect_bd_intf_net [get_bd_intf_pins S00_AXI] [get_bd_intf_pins axi_crossbar_0/S00_AXI]
connect_bd_intf_net [get_bd_intf_pins axi_intc_3/s_axi] [get_bd_intf_pins axi_crossbar_0/M03_AXI]
connect_bd_net -net zynq_ultra_ps_e_0_pl_clk0 [get_bd_pins PLCLK] \
  [get_bd_pins axi_intc_1/s_axi_aclk] [get_bd_pins axi_intc_0/s_axi_aclk] [get_bd_pins axi_intc_2/s_axi_aclk] \
  [get_bd_pins axi_intc_3/s_axi_aclk] [get_bd_pins axi_crossbar_0/aclk]
connect_bd_net -net rst_ps8_0_99M_peripheral_aresetn [get_bd_pins s_axi_aresetn] \
  [get_bd_pins axi_intc_1/s_axi_aresetn] [get_bd_pins axi_intc_0/s_axi_aresetn] [get_bd_pins axi_intc_2/s_axi_aresetn] \
  [get_bd_pins axi_intc_3/s_axi_aresetn] [get_bd_pins axi_crossbar_0/aresetn]
connect_bd_net -net O_INTR_IRQ_1 [get_bd_pins I_INTR_IRQ] \
  [get_bd_pins xlslice_1/Din] [get_bd_pins xlslice_2/Din] [get_bd_pins xlslice_3/Din] [get_bd_pins xlslice_0/Din]
connect_bd_net [get_bd_pins axi_intc_0/irq] [get_bd_pins xlconcat_4/In0]
connect_bd_net [get_bd_pins axi_intc_1/irq] [get_bd_pins xlconcat_4/In1]
connect_bd_net [get_bd_pins axi_intc_2/irq] [get_bd_pins xlconcat_4/In2]
connect_bd_net [get_bd_pins axi_intc_3/irq] [get_bd_pins xlconcat_4/In3]
connect_bd_net [get_bd_pins xlconcat_4/dout] [get_bd_pins irq]
connect_bd_net [get_bd_pins xlslice_0/Dout] [get_bd_pins axi_intc_0/intr]
connect_bd_net [get_bd_pins xlslice_1/Dout] [get_bd_pins axi_intc_1/intr]
connect_bd_net [get_bd_pins xlslice_2/Dout] [get_bd_pins axi_intc_2/intr]
connect_bd_net [get_bd_pins xlslice_3/Dout] [get_bd_pins axi_intc_3/intr]

current_bd_instance /intc_subsys_1
connect_bd_intf_net [get_bd_intf_pins axi_crossbar_0/M02_AXI] [get_bd_intf_pins axi_intc_2/s_axi]
connect_bd_intf_net [get_bd_intf_pins S00_AXI] [get_bd_intf_pins axi_crossbar_0/S00_AXI]
connect_bd_intf_net [get_bd_intf_pins axi_crossbar_0/M03_AXI] [get_bd_intf_pins axi_intc_3/s_axi]
connect_bd_intf_net [get_bd_intf_pins axi_crossbar_0/M01_AXI] [get_bd_intf_pins axi_intc_1/s_axi]
connect_bd_intf_net [get_bd_intf_pins axi_crossbar_0/M00_AXI] [get_bd_intf_pins axi_intc_0/s_axi]
connect_bd_net -net zynq_ultra_ps_e_0_pl_clk0 [get_bd_pins PLCLK] \
  [get_bd_pins axi_intc_1/s_axi_aclk] [get_bd_pins axi_intc_3/s_axi_aclk] [get_bd_pins axi_intc_2/s_axi_aclk] \
  [get_bd_pins axi_intc_0/s_axi_aclk] [get_bd_pins axi_crossbar_0/aclk]
connect_bd_net -net rst_ps8_0_99M_peripheral_aresetn [get_bd_pins s_axi_aresetn] \
  [get_bd_pins axi_intc_1/s_axi_aresetn] [get_bd_pins axi_intc_3/s_axi_aresetn] [get_bd_pins axi_intc_2/s_axi_aresetn] \
  [get_bd_pins axi_intc_0/s_axi_aresetn] [get_bd_pins axi_crossbar_0/aresetn]
connect_bd_net -net I_INTR_IRQ_1_1 [get_bd_pins I_INTR_IRQ] \
  [get_bd_pins xlslice_1/Din] [get_bd_pins xlslice_2/Din] [get_bd_pins xlslice_0/Din] [get_bd_pins xlslice_3/Din]
connect_bd_net [get_bd_pins xlconcat_5/dout] [get_bd_pins irq]
connect_bd_net [get_bd_pins axi_intc_0/irq] [get_bd_pins xlconcat_5/In0]
connect_bd_net [get_bd_pins axi_intc_1/irq] [get_bd_pins xlconcat_5/In1]
connect_bd_net [get_bd_pins axi_intc_2/irq] [get_bd_pins xlconcat_5/In2]
connect_bd_net [get_bd_pins axi_intc_3/irq] [get_bd_pins xlconcat_5/In3]
connect_bd_net [get_bd_pins xlslice_0/Dout] [get_bd_pins axi_intc_0/intr]
connect_bd_net [get_bd_pins xlslice_1/Dout] [get_bd_pins axi_intc_1/intr]
connect_bd_net [get_bd_pins xlslice_2/Dout] [get_bd_pins axi_intc_2/intr]
connect_bd_net [get_bd_pins xlslice_3/Dout] [get_bd_pins axi_intc_3/intr]

current_bd_instance /intc_subsys_2
connect_bd_intf_net [get_bd_intf_pins axi_crossbar_0/M02_AXI] [get_bd_intf_pins axi_intc_2/s_axi]
connect_bd_intf_net [get_bd_intf_pins axi_crossbar_0/M00_AXI] [get_bd_intf_pins axi_intc_0/s_axi]
connect_bd_intf_net [get_bd_intf_pins axi_crossbar_0/M03_AXI] [get_bd_intf_pins axi_intc_3/s_axi]
connect_bd_intf_net [get_bd_intf_pins axi_crossbar_0/M01_AXI] [get_bd_intf_pins axi_intc_1/s_axi]
connect_bd_intf_net [get_bd_intf_pins S00_AXI] [get_bd_intf_pins axi_crossbar_0/S00_AXI]
connect_bd_net -net zynq_ultra_ps_e_0_pl_clk0 [get_bd_pins PLCLK] \
  [get_bd_pins axi_intc_1/s_axi_aclk] [get_bd_pins axi_intc_3/s_axi_aclk] [get_bd_pins axi_intc_2/s_axi_aclk] \
  [get_bd_pins axi_intc_0/s_axi_aclk] [get_bd_pins axi_crossbar_0/aclk]
connect_bd_net -net rst_ps8_0_99M_peripheral_aresetn [get_bd_pins s_axi_aresetn] \
  [get_bd_pins axi_intc_1/s_axi_aresetn] [get_bd_pins axi_intc_3/s_axi_aresetn] [get_bd_pins axi_intc_2/s_axi_aresetn] \
  [get_bd_pins axi_intc_0/s_axi_aresetn] [get_bd_pins axi_crossbar_0/aresetn]
connect_bd_net -net I_INTR_IRQ_1_1 [get_bd_pins I_INTR_IRQ] \
  [get_bd_pins xlslice_1/Din] [get_bd_pins xlslice_2/Din] [get_bd_pins xlslice_0/Din] [get_bd_pins xlslice_3/Din]
connect_bd_net [get_bd_pins xlconcat_5/dout] [get_bd_pins irq]
connect_bd_net [get_bd_pins axi_intc_0/irq] [get_bd_pins xlconcat_5/In0]
connect_bd_net [get_bd_pins axi_intc_1/irq] [get_bd_pins xlconcat_5/In1]
connect_bd_net [get_bd_pins axi_intc_2/irq] [get_bd_pins xlconcat_5/In2]
connect_bd_net [get_bd_pins axi_intc_3/irq] [get_bd_pins xlconcat_5/In3]
connect_bd_net [get_bd_pins xlslice_0/Dout] [get_bd_pins axi_intc_0/intr]
connect_bd_net [get_bd_pins xlslice_1/Dout] [get_bd_pins axi_intc_1/intr]
connect_bd_net [get_bd_pins xlslice_2/Dout] [get_bd_pins axi_intc_2/intr]
connect_bd_net [get_bd_pins xlslice_3/Dout] [get_bd_pins axi_intc_3/intr]

current_bd_instance /intc_subsys_3
connect_bd_intf_net [get_bd_intf_pins axi_intc_0/s_axi] [get_bd_intf_pins axi_interconnect_0/M00_AXI]
connect_bd_intf_net [get_bd_intf_pins axi_intc_1/s_axi] [get_bd_intf_pins axi_interconnect_0/M01_AXI]
connect_bd_intf_net [get_bd_intf_pins axi_intc_3/s_axi] [get_bd_intf_pins axi_interconnect_0/M03_AXI]
connect_bd_intf_net [get_bd_intf_pins S00_AXI] [get_bd_intf_pins axi_interconnect_0/S00_AXI]
connect_bd_intf_net [get_bd_intf_pins axi_intc_2/s_axi] [get_bd_intf_pins axi_interconnect_0/M02_AXI]
connect_bd_net -net zynq_ultra_ps_e_0_pl_clk0 [get_bd_pins PLCLK] \
  [get_bd_pins axi_intc_1/s_axi_aclk] [get_bd_pins axi_intc_3/s_axi_aclk] [get_bd_pins axi_intc_2/s_axi_aclk] \
  [get_bd_pins axi_intc_0/s_axi_aclk] [get_bd_pins axi_interconnect_0/ACLK] [get_bd_pins axi_interconnect_0/S00_ACLK] \
  [get_bd_pins axi_interconnect_0/M00_ACLK] [get_bd_pins axi_interconnect_0/M01_ACLK] \
  [get_bd_pins axi_interconnect_0/M02_ACLK] [get_bd_pins axi_interconnect_0/M03_ACLK]
connect_bd_net -net rst_ps8_0_99M_peripheral_aresetn [get_bd_pins s_axi_aresetn] \
  [get_bd_pins axi_intc_1/s_axi_aresetn] [get_bd_pins axi_intc_3/s_axi_aresetn] [get_bd_pins axi_intc_2/s_axi_aresetn] \
  [get_bd_pins axi_intc_0/s_axi_aresetn] [get_bd_pins axi_interconnect_0/ARESETN] \
  [get_bd_pins axi_interconnect_0/S00_ARESETN] [get_bd_pins axi_interconnect_0/M00_ARESETN] \
  [get_bd_pins axi_interconnect_0/M01_ARESETN] [get_bd_pins axi_interconnect_0/M02_ARESETN] \
  [get_bd_pins axi_interconnect_0/M03_ARESETN]
connect_bd_net -net I_INTR_IRQ_1_1 [get_bd_pins I_INTR_IRQ] \
  [get_bd_pins xlslice_1/Din] [get_bd_pins xlslice_2/Din] [get_bd_pins xlslice_0/Din] [get_bd_pins xlslice_3/Din]
connect_bd_net [get_bd_pins xlconcat_5/dout] [get_bd_pins irq]
connect_bd_net [get_bd_pins axi_intc_0/irq] [get_bd_pins xlconcat_5/In0]
connect_bd_net [get_bd_pins axi_intc_1/irq] [get_bd_pins xlconcat_5/In1]
connect_bd_net [get_bd_pins axi_intc_2/irq] [get_bd_pins xlconcat_5/In2]
connect_bd_net [get_bd_pins axi_intc_3/irq] [get_bd_pins xlconcat_5/In3]
connect_bd_net [get_bd_pins xlslice_1/Dout] [get_bd_pins axi_intc_1/intr]
connect_bd_net [get_bd_pins xlslice_0/Dout] [get_bd_pins axi_intc_0/intr]
connect_bd_net [get_bd_pins xlslice_3/Dout] [get_bd_pins axi_intc_3/intr]
connect_bd_net [get_bd_pins xlslice_2/Dout] [get_bd_pins axi_intc_2/intr]

current_bd_instance /
connect_bd_intf_net [get_bd_intf_ports GPIO] [get_bd_intf_pins zynq_ultra_ps_e_0/GPIO_0]
connect_bd_intf_net [get_bd_intf_pins blk_mem_gen_0/BRAM_PORTA] [get_bd_intf_pins axi_bram_ctrl_0/BRAM_PORTA]
connect_bd_intf_net [get_bd_intf_pins axi_bram_ctrl_0/S_AXI] [get_bd_intf_pins smartconnect_1/M00_AXI]
connect_bd_intf_net [get_bd_intf_pins smartconnect_0/M00_AXI] [get_bd_intf_pins intc_subsys_0/S00_AXI]
connect_bd_intf_net [get_bd_intf_ports PLCFG_M_AXI] [get_bd_intf_pins smartconnect_1/M02_AXI]
connect_bd_intf_net [get_bd_intf_pins smartconnect_1/S00_AXI] [get_bd_intf_pins zynq_ultra_ps_e_0/M_AXI_HPM1_FPD]
connect_bd_intf_net [get_bd_intf_pins axi_bram_ctrl_1/BRAM_PORTA] [get_bd_intf_pins blk_mem_gen_1/BRAM_PORTA]
connect_bd_intf_net [get_bd_intf_pins smartconnect_0/M03_AXI] [get_bd_intf_pins intc_subsys_3/S00_AXI]
connect_bd_intf_net [get_bd_intf_pins zynq_ultra_ps_e_0/M_AXI_HPM0_FPD] [get_bd_intf_pins smartconnect_0/S00_AXI]
connect_bd_intf_net [get_bd_intf_pins axi_bram_ctrl_1/BRAM_PORTA] [get_bd_intf_pins blk_mem_gen_1/BRAM_PORTA]
connect_bd_intf_net [get_bd_intf_pins smartconnect_1/M01_AXI] [get_bd_intf_pins axi_bram_ctrl_1/S_AXI]
connect_bd_intf_net [get_bd_intf_pins smartconnect_0/M01_AXI] [get_bd_intf_pins intc_subsys_1/S00_AXI]
connect_bd_intf_net [get_bd_intf_ports RX_BRAM_PORTB] [get_bd_intf_pins blk_mem_gen_1/BRAM_PORTB]
connect_bd_intf_net [get_bd_intf_ports TX_BRAM_PORTB] [get_bd_intf_pins blk_mem_gen_0/BRAM_PORTB]
connect_bd_net -net I_INTR_IRQ_0_1 [get_bd_ports I_INTR_IRQ_0] [get_bd_pins intc_subsys_0/I_INTR_IRQ]
connect_bd_net -net I_INTR_IRQ_1_1 [get_bd_ports I_INTR_IRQ_1] [get_bd_pins intc_subsys_1/I_INTR_IRQ]
connect_bd_net -net I_INTR_IRQ_2_1 [get_bd_ports I_INTR_IRQ_2] [get_bd_pins intc_subsys_2/I_INTR_IRQ]
connect_bd_net -net aclk1_0_1 [get_bd_ports prot_clk] \
  [get_bd_pins smartconnect_1/aclk1] [get_bd_pins axi_bram_ctrl_0/s_axi_aclk] [get_bd_pins axi_bram_ctrl_1/s_axi_aclk] \
  [get_bd_pins proc_prot_reset/slowest_sync_clk]
connect_bd_net -net ext_reset_in_0_1 [get_bd_ports prot_clk_rstn] [get_bd_pins proc_prot_reset/ext_reset_in]
connect_bd_net [get_bd_pins intc_subsys_0/irq] [get_bd_pins xlconcat_5/In0]
connect_bd_net [get_bd_pins proc_prot_reset/peripheral_aresetn] \
  [get_bd_pins axi_bram_ctrl_0/s_axi_aresetn] [get_bd_pins axi_bram_ctrl_1/s_axi_aresetn]
connect_bd_net [get_bd_pins rst_ps8_0_99M/peripheral_aresetn] \
  [get_bd_pins smartconnect_1/aresetn] [get_bd_pins smartconnect_0/aresetn] [get_bd_pins intc_subsys_0/s_axi_aresetn] \
  [get_bd_pins intc_subsys_1/s_axi_aresetn] [get_bd_pins intc_subsys_2/s_axi_aresetn] \
  [get_bd_pins intc_subsys_3/s_axi_aresetn]
connect_bd_net [get_bd_pins xlconcat_5/dout] [get_bd_pins zynq_ultra_ps_e_0/pl_ps_irq0]
connect_bd_net [get_bd_pins zynq_ultra_ps_e_0/pl_clk0] \
  [get_bd_pins zynq_ultra_ps_e_0/maxihpm0_fpd_aclk] [get_bd_pins rst_ps8_0_99M/slowest_sync_clk] [get_bd_ports PLCLK] \
  [get_bd_pins zynq_ultra_ps_e_0/maxihpm1_fpd_aclk] [get_bd_pins smartconnect_1/aclk] [get_bd_pins smartconnect_0/aclk] \
  [get_bd_pins intc_subsys_0/PLCLK] [get_bd_pins intc_subsys_1/PLCLK] [get_bd_pins intc_subsys_2/PLCLK] \
  [get_bd_pins intc_subsys_3/PLCLK]
connect_bd_net [get_bd_pins zynq_ultra_ps_e_0/pl_resetn0] [get_bd_pins rst_ps8_0_99M/ext_reset_in] [get_bd_ports PLRESETN]
connect_bd_net [get_bd_pins intc_subsys_1/irq] [get_bd_pins xlconcat_5/In1]
connect_bd_net [get_bd_pins xlconcat_6/dout] [get_bd_pins zynq_ultra_ps_e_0/pl_ps_irq1]
connect_bd_net [get_bd_pins intc_subsys_2/irq] [get_bd_pins xlconcat_6/In0]
connect_bd_net -net I_INTR_IRQ_3_1 [get_bd_ports I_INTR_IRQ_3] [get_bd_pins intc_subsys_3/I_INTR_IRQ]
connect_bd_net [get_bd_pins intc_subsys_3/irq] [get_bd_pins xlconcat_6/In1]

# ---- address map ----
assign_bd_address -offset 0x00A0000000 -range 4K -target_address_space [get_bd_addr_spaces zynq_ultra_ps_e_0/Data] [get_bd_addr_segs intc_subsys_0/axi_intc_0/S_AXI/Reg]
assign_bd_address -offset 0x00A0001000 -range 4K -target_address_space [get_bd_addr_spaces zynq_ultra_ps_e_0/Data] [get_bd_addr_segs intc_subsys_0/axi_intc_1/S_AXI/Reg]
assign_bd_address -offset 0x00A0002000 -range 4K -target_address_space [get_bd_addr_spaces zynq_ultra_ps_e_0/Data] [get_bd_addr_segs intc_subsys_0/axi_intc_2/S_AXI/Reg]
assign_bd_address -offset 0x00A0003000 -range 4K -target_address_space [get_bd_addr_spaces zynq_ultra_ps_e_0/Data] [get_bd_addr_segs intc_subsys_0/axi_intc_3/S_AXI/Reg]
assign_bd_address -offset 0x00A0004000 -range 4K -target_address_space [get_bd_addr_spaces zynq_ultra_ps_e_0/Data] [get_bd_addr_segs intc_subsys_1/axi_intc_0/S_AXI/Reg]
assign_bd_address -offset 0x00A0005000 -range 4K -target_address_space [get_bd_addr_spaces zynq_ultra_ps_e_0/Data] [get_bd_addr_segs intc_subsys_1/axi_intc_1/S_AXI/Reg]
assign_bd_address -offset 0x00A0006000 -range 4K -target_address_space [get_bd_addr_spaces zynq_ultra_ps_e_0/Data] [get_bd_addr_segs intc_subsys_1/axi_intc_2/S_AXI/Reg]
assign_bd_address -offset 0x00A0007000 -range 4K -target_address_space [get_bd_addr_spaces zynq_ultra_ps_e_0/Data] [get_bd_addr_segs intc_subsys_1/axi_intc_3/S_AXI/Reg]
assign_bd_address -offset 0x00A0008000 -range 4K -target_address_space [get_bd_addr_spaces zynq_ultra_ps_e_0/Data] [get_bd_addr_segs intc_subsys_2/axi_intc_0/S_AXI/Reg]
assign_bd_address -offset 0x00A0009000 -range 4K -target_address_space [get_bd_addr_spaces zynq_ultra_ps_e_0/Data] [get_bd_addr_segs intc_subsys_2/axi_intc_1/S_AXI/Reg]
assign_bd_address -offset 0x00A000A000 -range 4K -target_address_space [get_bd_addr_spaces zynq_ultra_ps_e_0/Data] [get_bd_addr_segs intc_subsys_2/axi_intc_2/S_AXI/Reg]
assign_bd_address -offset 0x00A000B000 -range 4K -target_address_space [get_bd_addr_spaces zynq_ultra_ps_e_0/Data] [get_bd_addr_segs intc_subsys_2/axi_intc_3/S_AXI/Reg]
assign_bd_address -offset 0x00A000C000 -range 4K -target_address_space [get_bd_addr_spaces zynq_ultra_ps_e_0/Data] [get_bd_addr_segs intc_subsys_3/axi_intc_0/S_AXI/Reg]
assign_bd_address -offset 0x00A000D000 -range 4K -target_address_space [get_bd_addr_spaces zynq_ultra_ps_e_0/Data] [get_bd_addr_segs intc_subsys_3/axi_intc_1/S_AXI/Reg]
assign_bd_address -offset 0x00A000E000 -range 4K -target_address_space [get_bd_addr_spaces zynq_ultra_ps_e_0/Data] [get_bd_addr_segs intc_subsys_3/axi_intc_2/S_AXI/Reg]
assign_bd_address -offset 0x00A000F000 -range 4K -target_address_space [get_bd_addr_spaces zynq_ultra_ps_e_0/Data] [get_bd_addr_segs intc_subsys_3/axi_intc_3/S_AXI/Reg]
assign_bd_address -offset 0x00B0000000 -range 64K -target_address_space [get_bd_addr_spaces zynq_ultra_ps_e_0/Data] [get_bd_addr_segs axi_bram_ctrl_0/S_AXI/Mem0]
assign_bd_address -offset 0x00B0010000 -range 64K -target_address_space [get_bd_addr_spaces zynq_ultra_ps_e_0/Data] [get_bd_addr_segs axi_bram_ctrl_1/S_AXI/Mem0]
assign_bd_address -offset 0x00B0100000 -range 1M -target_address_space [get_bd_addr_spaces zynq_ultra_ps_e_0/Data] [get_bd_addr_segs PLCFG_M_AXI/Reg]

validate_bd_design
save_bd_design
